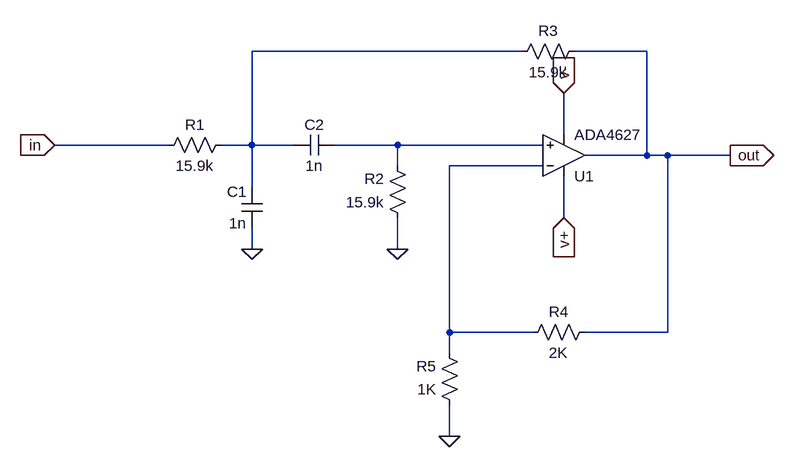
[diagram p0: schematic Draft2.asc]
Draft2.asc, the LTspice schematic file:
Version 4
SHEET 1 1040 680
WIRE 624 -96 208 -96
WIRE 816 -96 704 -96
WIRE 688 32 688 -32
WIRE 80 48 -96 48
WIRE 208 48 208 -96
WIRE 208 48 160 48
WIRE 272 48 208 48
WIRE 432 48 336 48
WIRE 656 48 432 48
WIRE 816 64 816 -96
WIRE 816 64 720 64
WIRE 848 64 816 64
WIRE 944 64 848 64
WIRE 432 80 432 48
WIRE 656 80 512 80
WIRE 208 112 208 48
WIRE 688 160 688 96
WIRE 208 208 208 176
WIRE 432 208 432 160
WIRE 512 336 512 80
WIRE 640 336 512 336
WIRE 848 336 848 64
WIRE 848 336 720 336
WIRE 512 368 512 336
WIRE 512 496 512 448
FLAG 432 208 0
FLAG 208 208 0
FLAG 512 496 0
FLAG -96 48 in
IOPIN -96 48 In
FLAG 688 -32 v-
IOPIN 688 -32 In
FLAG 688 160 v+
IOPIN 688 160 In
FLAG 944 64 out
IOPIN 944 64 Out
DATAFLAG 240 48 ""
DATAFLAG 512 48 ""
DATAFLAG 592 80 ""
DATAFLAG 784 64 ""
SYMBOL cap 224 112 M0
SYMATTR InstName C1
SYMATTR Value 1n
SYMBOL res 176 32 R90
WINDOW 0 0 56 VBottom 2
WINDOW 3 32 56 VTop 2
SYMATTR InstName R1
SYMATTR Value 15.9k
SYMBOL res 448 176 R180
WINDOW 0 36 76 Left 2
WINDOW 3 36 40 Left 2
SYMATTR InstName R2
SYMATTR Value 15.9k
SYMBOL cap 272 64 R270
WINDOW 0 32 32 VTop 2
WINDOW 3 0 32 VBottom 2
SYMATTR InstName C2
SYMATTR Value 1n
SYMBOL res 720 -112 R90
WINDOW 0 0 56 VBottom 2
WINDOW 3 32 56 VTop 2
SYMATTR InstName R3
SYMATTR Value 15.9k
SYMBOL res 736 320 R90
WINDOW 0 0 56 VBottom 2
WINDOW 3 32 56 VTop 2
SYMATTR InstName R4
SYMATTR Value 2K
SYMBOL res 528 464 R180
WINDOW 0 36 76 Left 2
WINDOW 3 36 40 Left 2
SYMATTR InstName R5
SYMATTR Value 1K
SYMBOL OpAmps\\ADA4627 688 128 M180
SYMATTR InstName U1

The netlist it stands for:
* Draft2.asc
C1 N001 0 1n
R1 N001 in 15.9k
R2 0 N002 15.9k
C2 N001 N002 1n
R3 out N001 15.9k
R4 out N003 2K
R5 0 N003 1K
XU1 N002 N003 v+ v- out ADA4627  ; pins In+ In- V+ V- OUT
.backanno
.end